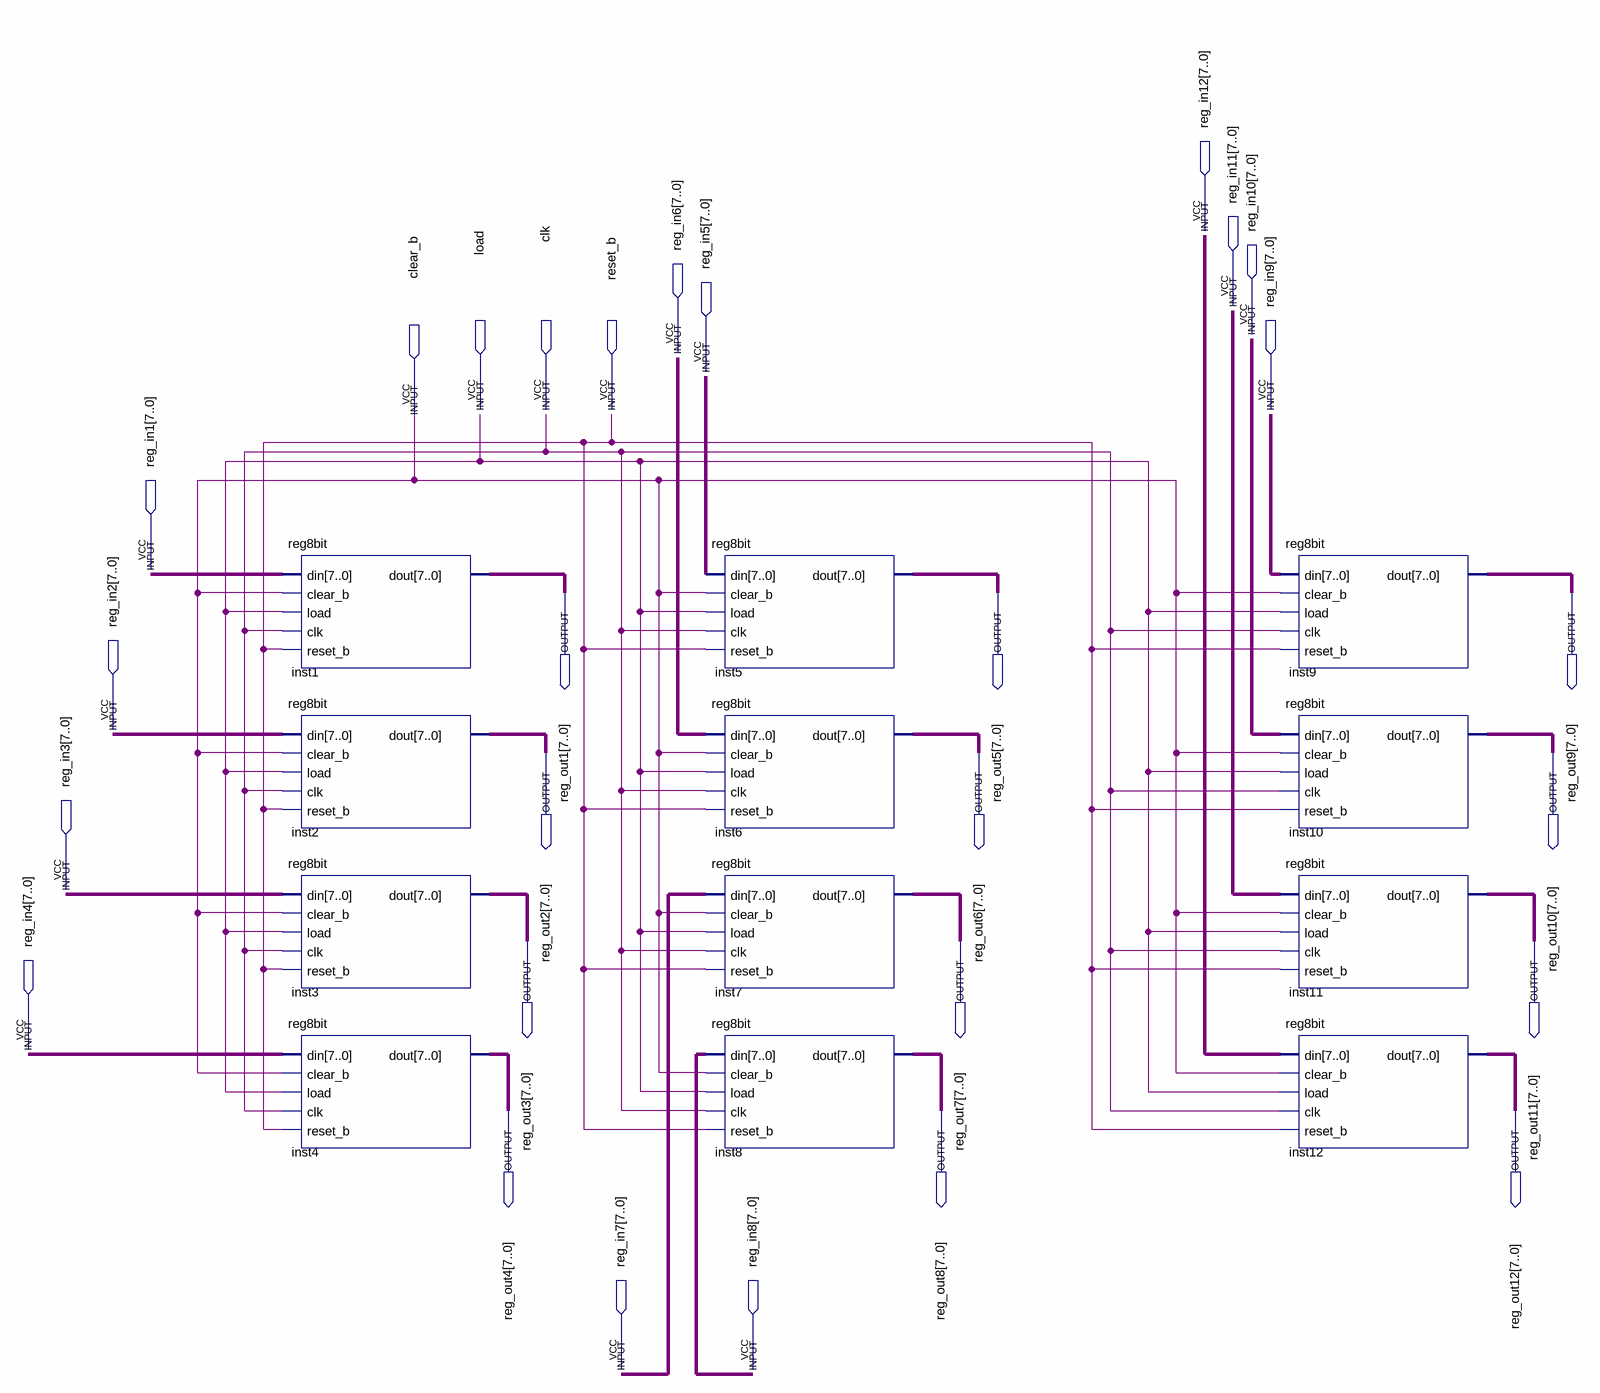
[diagram p0: schematic sheet]
// Quartus schematic reg96bit.bdf as structural Verilog: 12 symbols, 28 pins
module reg96bit (
  input  [7:0] reg_in12,
  input  [7:0] reg_in11,
  input  [7:0] reg_in10,
  input  [7:0] reg_in6,
  input  [7:0] reg_in5,
  input  clear_b,
  input  load,
  input  clk,
  input  reset_b,
  input  [7:0] reg_in9,
  input  [7:0] reg_in1,
  input  [7:0] reg_in2,
  input  [7:0] reg_in3,
  input  [7:0] reg_in4,
  input  [7:0] reg_in7,
  input  [7:0] reg_in8,
  output [7:0] reg_out1,
  output [7:0] reg_out5,
  output [7:0] reg_out9,
  output [7:0] reg_out2,
  output [7:0] reg_out6,
  output [7:0] reg_out10,
  output [7:0] reg_out3,
  output [7:0] reg_out7,
  output [7:0] reg_out11,
  output [7:0] reg_out4,
  output [7:0] reg_out8,
  output [7:0] reg_out12
);

  reg8bit inst1 (.din(reg_in1), .clear_b(clear_b), .load(load), .clk(clk), .reset_b(reset_b), .dout(reg_out1));
  reg8bit inst2 (.din(reg_in2), .clear_b(clear_b), .load(load), .clk(clk), .reset_b(reset_b), .dout(reg_out2));
  reg8bit inst3 (.din(reg_in3), .clear_b(clear_b), .load(load), .clk(clk), .reset_b(reset_b), .dout(reg_out3));
  reg8bit inst4 (.din(reg_in4), .clear_b(clear_b), .load(load), .clk(clk), .reset_b(reset_b), .dout(reg_out4));
  reg8bit inst5 (.din(reg_in5), .clear_b(clear_b), .load(load), .clk(clk), .reset_b(reset_b), .dout(reg_out5));
  reg8bit inst6 (.din(reg_in6), .clear_b(clear_b), .load(load), .clk(clk), .reset_b(reset_b), .dout(reg_out6));
  reg8bit inst7 (.din(reg_in7), .clear_b(clear_b), .load(load), .clk(clk), .reset_b(reset_b), .dout(reg_out7));
  reg8bit inst8 (.din(reg_in8), .clear_b(clear_b), .load(load), .clk(clk), .reset_b(reset_b), .dout(reg_out8));
  reg8bit inst9 (.din(reg_in9), .clear_b(clear_b), .load(load), .clk(clk), .reset_b(reset_b), .dout(reg_out9));
  reg8bit inst10 (.din(reg_in10), .clear_b(clear_b), .load(load), .clk(clk), .reset_b(reset_b), .dout(reg_out10));
  reg8bit inst11 (.din(reg_in11), .clear_b(clear_b), .load(load), .clk(clk), .reset_b(reset_b), .dout(reg_out11));
  reg8bit inst12 (.din(reg_in12), .clear_b(clear_b), .load(load), .clk(clk), .reset_b(reset_b), .dout(reg_out12));
endmodule
